# EasyEDA Pro project Image_sensor.eprj

# Schematic Schematic1
Board Name: Board1; Create Date: 2025-08-01; Page Name: P1; Project Name: Image_sensor; Schematic Name: Schematic1; Update Date: 2025-08-01; Company: 嘉立创EDA; Page Size: A4; Version: V1.0
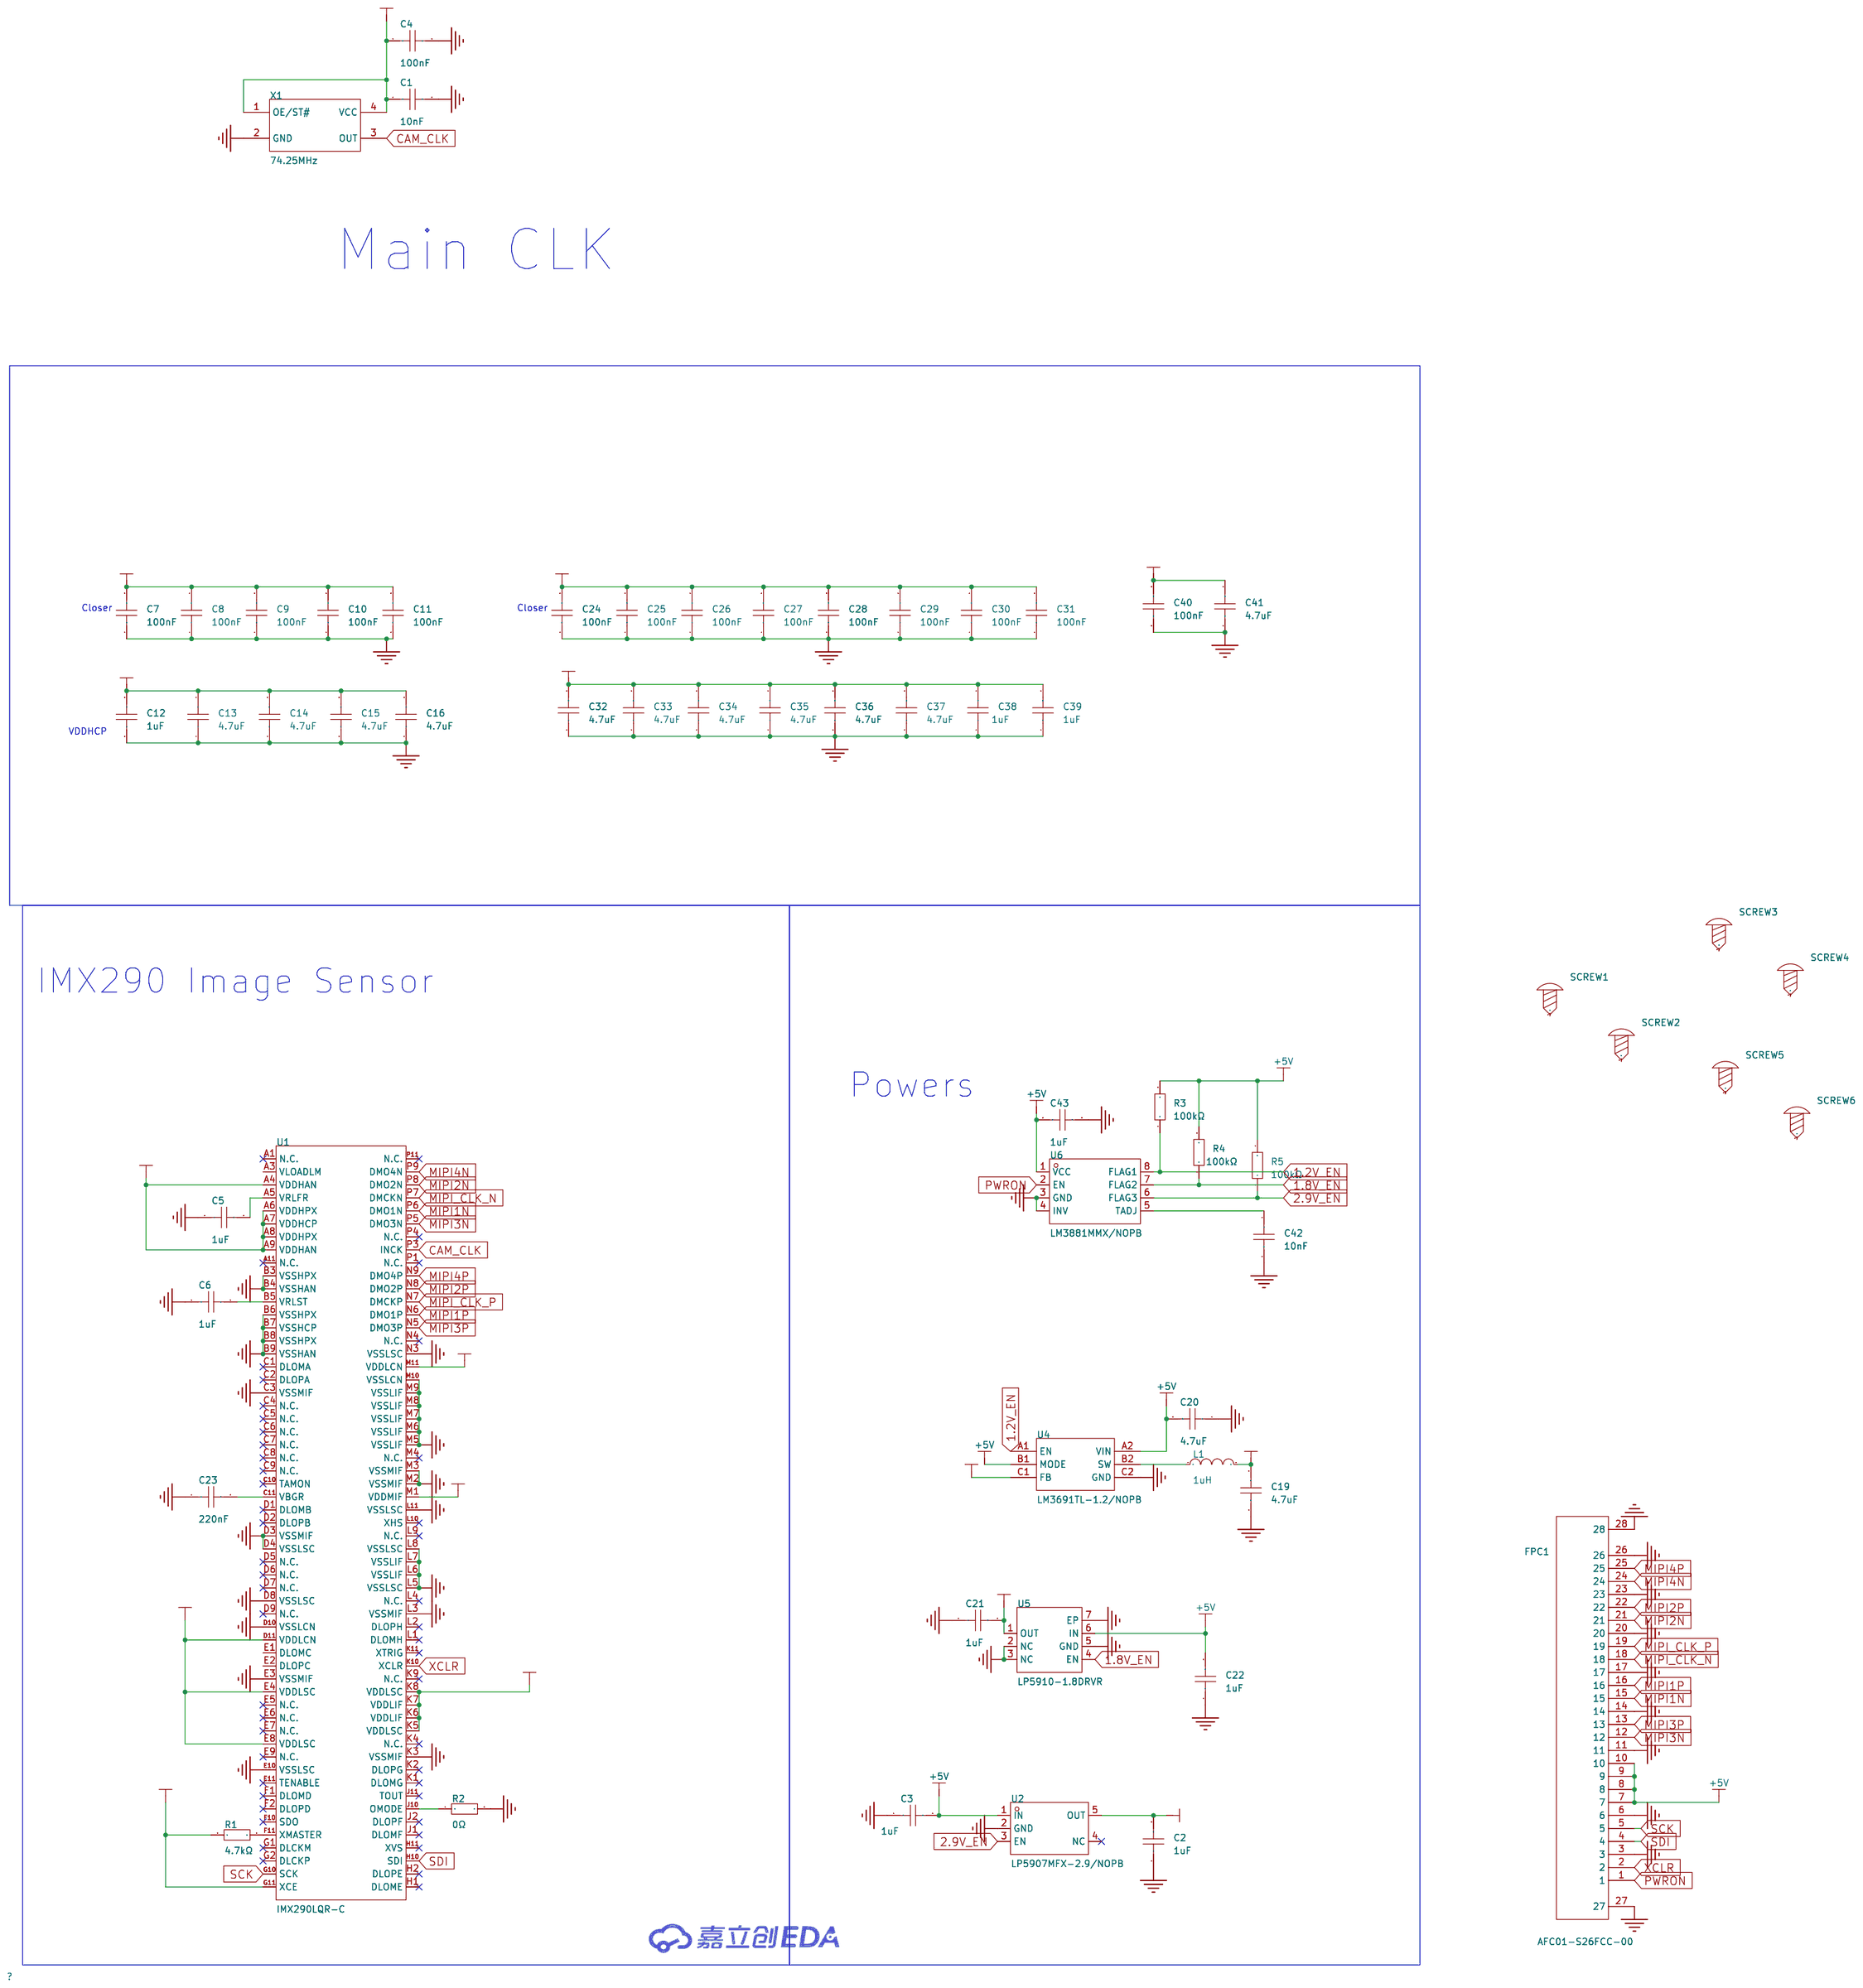
[diagram p0: schematic sheet]

## Parts
C1  10nF  [C01005]
C2  1uF  [C0201]
C3  1uF  [C0201]
C4  100nF  [C01005]
C5  1uF  [C0201]
C6  1uF  [C0201]
C7  100nF  [C01005]
C8  100nF  [C01005]
C9  100nF  [C01005]
C10  100nF  [C01005]
C11  100nF  [C01005]
C12  1uF  [C0201]
C13  4.7uF  [C0201]
C14  4.7uF  [C0201]
C15  4.7uF  [C0201]
C16  4.7uF  [C0201]
C19  4.7uF  [C0201]
C20  4.7uF  [C0201]
C21  1uF  [C0201]
C22  1uF  [C0201]
C23  220nF  [C01005]
C24  100nF  [C01005]
C25  100nF  [C01005]
C26  100nF  [C01005]
C27  100nF  [C01005]
C28  100nF  [C01005]
C29  100nF  [C01005]
C30  100nF  [C01005]
C31  100nF  [C01005]
C32  4.7uF  [C0201]
C33  4.7uF  [C0201]
C34  4.7uF  [C0201]
C35  4.7uF  [C0201]
C36  4.7uF  [C0201]
C37  4.7uF  [C0201]
C38  1uF  [C0201]
C39  1uF  [C0201]
C40  100nF  [C01005]
C41  4.7uF  [C0201]
C42  10nF  [C0201]
C43  1uF  [C0201]
FPC1  AFC01-S26FCC-00  [FPC-SMD_AFC01-S26FCC-00]
L1  1uH  [IND-SMD_L2.0-W1.6_MPH201610]
R1  4.7kΩ  [R0201]
R2  0Ω  [R0603]
R3  100kΩ  [R0201]
R4  100kΩ  [R0201]
R5  100kΩ  [R0201]
SCREW1  -  [M2螺丝]
SCREW2  -  [M2螺丝]
SCREW3  -  [M2螺丝]
SCREW4  -  [M2螺丝]
SCREW5  -  [M2螺丝]
SCREW6  -  [M2螺丝]
U1  IMX290LQR-C  [LGA-110_L12.0-W9.3-P0.80-BL_IMX291LQR-C]
U2  LP5907MFX-2.9/NOPB  [SOT-23-5_L2.9-W1.6-P0.95-LS2.8-BR]
U4  LM3691TL-1.2/NOPB  [DSBGA-6_L1.5-W1.3-R2-C3-P0.50-BL]
U5  LP5910-1.8DRVR  [WSON-6_L2.0-W2.0-P0.65-TL-EP]
U6  LM3881MMX/NOPB  [VSSOP-8_L3.0-W3.0-P0.65-LS5.0-BL]
X1  74.25MHz  [OSC-SMD_4P-L7.0-W5.0-BL_SG7050]

## Library data of the parts
C1 = CL02A103KQ2NNXC: LCSC Part Name: 10nF ±10% 6.3V; Supplier Part: C307375; Manufacturer: SAMSUNG(三星); Supplier Footprint: 01005; JLCPCB Part Class: Extended Part; Datasheet: https://atta.szlcsc.com/upload/public/pdf/source/20160218/1457707763339.pdf; Supplier: LCSC; Tolerance: ±10%; Voltage Rating: 6.3V; Temperature Coefficient: X5R
C2 C3 C5 C6 C12 C21 C22 C38 C39 = CL03A105KP3NSNC: LCSC Part Name: 1uF ±10% 10V; Supplier Part: C5209398; Manufacturer: SAMSUNG(三星); Supplier Footprint: 0201; JLCPCB Part Class: Extended Part; Datasheet: https://atta.szlcsc.com/upload/public/pdf/source/20191106/C444885_D1DE823F0ED498E02883F0194C396E9C.pdf; Supplier: LCSC; Tolerance: ±10%; Voltage Rated: 10V; Temperature Coefficient: X5R
C4 C7-C11 C24-C31 C40 = GRM022R60J104KE15D: LCSC Part Name: 100nF ±10% 6.3V; Supplier Part: C161362; Manufacturer: muRata(村田); Supplier Footprint: 01005; JLCPCB Part Class: Extended Part; Datasheet: https://atta.szlcsc.com/upload/public/pdf/source/20200305/C490387_23319AE8C154DEB24C505E6C82A8106A.pdf; Supplier: LCSC; Tolerance: ±10%; Voltage Rating: 6.3V; Temperature Coefficient: X5R
C13-C16 C19 C20 C32-C37 C41 = GRM035R60J475ME15D: LCSC Part Name: 4.7uF ±20% 6.3V; Supplier Part: C335103; Manufacturer: muRata(村田); Supplier Footprint: 0201; JLCPCB Part Class: Extended Part; Datasheet: https://atta.szlcsc.com/upload/public/pdf/source/20200305/C490387_23319AE8C154DEB24C505E6C82A8106A.pdf; Supplier: LCSC; Tolerance: ±20%; Voltage Rating: 6.3V; Temperature Coefficient: X5R
C23 = GRM022R60J224KE14D: LCSC Part Name: 220nF ±10% 6.3V; Supplier Part: C883592; Manufacturer: muRata(村田); Supplier Footprint: 01005; JLCPCB Part Class: Extended Part; Datasheet: https://atta.szlcsc.com/upload/public/pdf/source/20201027/C883551_458405A74FCB13773427E37ABAEDB4CB.pdf; Supplier: LCSC; Tolerance: ±10%; Voltage Rating: 6.3V
C42 = GRM033R71A103KA01D: LCSC Part Name: 10nF ±10% 10V; Supplier Part: C76941; Manufacturer: muRata(村田); Supplier Footprint: 0201; JLCPCB Part Class: Extended Part; Datasheet: https://atta.szlcsc.com/upload/public/pdf/source/20180307/C76941_15204091038901407729.pdf; Supplier: LCSC; Tolerance: ±10%; Voltage Rated: 10V; Temperature Coefficient: X7R
C43 = GRM033R61A105ME44D: LCSC Part Name: 1uF ±20% 10V; Supplier Part: C76935; Manufacturer: muRata(村田); Supplier Footprint: 0201; JLCPCB Part Class: Extended Part; Datasheet: https://atta.szlcsc.com/upload/public/pdf/source/20190904/C426118_85E81C7C1F21FC87C5FB6D536E0847B4.pdf; Supplier: LCSC; Tolerance: ±20%; Voltage Rated: 10V; Temperature Coefficient: X5R
FPC1 = AFC01-S26FCC-00: LCSC Part Name: 间距:0.5mm P数:26P 翻盖式 下接; Supplier Part: C262277; Manufacturer: JS(钜硕电子); Supplier Footprint: SMD,P=0.5mm,卧贴; JLCPCB Part Class: Extended Part; Datasheet: https://atta.szlcsc.com/upload/public/pdf/source/20190816/C413942_2A72D1AC756EAE17EEDF756A339D4500.pdf; Supplier: LCSC; Locking Feature: 翻盖式; Contact Type: 下接; Number of Contacts: 26P; Pitch: 0.5mm; Mounting Type: 卧贴; FFC, FCB Thickness: 0.3mm; Height Above Board: 2mm
L1 = MPH201610S1R0MT: LCSC Part Name: 1uH ±20% 1A; Supplier Part: C279813; Manufacturer: Sunlord(顺络); Supplier Footprint: 0806; JLCPCB Part Class: Extended Part; Datasheet: https://atta.szlcsc.com/upload/public/pdf/source/20241120/D50FD5550E500CE51CF2F3A3AE14E46E.pdf; Supplier: LCSC; Tolerance: ±20%; Rated Current: 1A; Current - Saturation (Isat): 1A; DC Resistance(DCR): 90mΩ; Frequency - Self Resonant: 70MHz
R1 = 0201WMF4701TEE: LCSC Part Name: 4.7kΩ ±1% 50mW 厚膜电阻; Supplier Part: C270346; Manufacturer: UNI-ROYAL(厚声); Supplier Footprint: 0201; JLCPCB Part Class: Extended Part; Datasheet: https://atta.szlcsc.com/upload/public/pdf/source/20200306/C422600_1E6D84923E4A46A82E41ADD87F860B5C.pdf; Supplier: LCSC; Type: 厚膜电阻; Tolerance: ±1%; Power(Watts): 50mW; Overload Voltage (Max): 25V; Temperature Coefficient: ±200ppm/℃; Operating Temperature Range: -55℃~+155℃
R2 = 0603WAF0000T5E: LCSC Part Name: 0Ω ±1% 100mW 厚膜电阻; Supplier Part: C21189; Manufacturer: UNI-ROYAL(厚声); Supplier Footprint: 0603; JLCPCB Part Class: Basic Part; Datasheet: https://atta.szlcsc.com/upload/public/pdf/source/20200306/C422600_1E6D84923E4A46A82E41ADD87F860B5C.pdf; Supplier: LCSC; Type: 厚膜电阻; Tolerance: ±1%; Power(Watts): 100mW; Voltage-Supply(Max): 75V; Operating Temperature: -55℃~+155℃
R3-R5 = 0201WMF1003TEE: LCSC Part Name: 100kΩ ±1% 50mW 厚膜电阻; Supplier Part: C270364; Manufacturer: UNI-ROYAL(厚声); Supplier Footprint: 0201; JLCPCB Part Class: Extended Part; Datasheet: https://atta.szlcsc.com/upload/public/pdf/source/20200306/C422600_1E6D84923E4A46A82E41ADD87F860B5C.pdf; Supplier: LCSC; Type: 厚膜电阻; Tolerance: ±1%; Power(Watts): 50mW; Overload Voltage (Max): 25V; Temperature Coefficient: ±200ppm/℃; Operating Temperature Range: -55℃~+155℃
SCREW1-SCREW6 = M2螺丝: Supplier Footprint: 插件
U1 = IMX290LQR-C: Supplier Part: C5249315; Manufacturer: Sony(索尼); Supplier Footprint: LGA-110; JLCPCB Part Class: 扩展库; Datasheet: https://atta.szlcsc.com/upload/public/pdf/source/20230906/B553CB6F46D914DB518133BEFA776B57.pdf; Supplier: LCSC
U2 = LP5907MFX-2.9/NOPB: LCSC Part Name: 具有低 IQ 和使能功能的 250mA、低噪声、高 PSRR、超低压降稳压器; Supplier Part: C2877839; Manufacturer: TI(德州仪器); Supplier Footprint: SOT-23-5; JLCPCB Part Class: Extended Part; Datasheet: https://www.ti.com/cn/lit/gpn/lp5907; Supplier: LCSC; Output Type: 固定; Maximum Input Voltage: 5.5V; Output Voltage: 2.9V; Output Current: 250mA; Dropout Voltage: 250mV@(250mA); standby current: 25uA; Feature: 防静电保护；短路保护；自动放电功能；低ESR；热保护(TSD)；欠压闭锁；带使能; Operating Temperature: -40℃~+125℃@(Tj); Output Polarity: 正极; Number of Outputs: 1
U4 = LM3691TL-1.2/NOPB: Supplier Part: C2072378; Manufacturer: TI(德州仪器); Supplier Footprint: DSBGA-6(1.3x1.5); JLCPCB Part Class: 扩展库; Datasheet: https://www.ti.com/cn/lit/gpn/lm3691; Supplier: LCSC; Function: 降压型; Output Type: 固定; Input Voltage: 2.3V~5.5V; Output Voltage: 1.2V; Output Current: 1A; Switching Frequency: 4MHz; Operating Temperature: -30℃~+85℃@(TA); Synchronous Rectification: 是; Number of Outputs: 1; Topology: 降压式; Switch tube (built-in/external): 内置
U5 = LP5910-1.8DRVR: LCSC Part Name: 具有反向电流保护和使能功能的 300mA、低噪声、低 IQ、低压降稳压器; Supplier Part: C2867568; Manufacturer: TI(德州仪器); Supplier Footprint: WSON-6-EP(2x2); JLCPCB Part Class: 扩展库; Datasheet: https://www.ti.com/cn/lit/gpn/lp5910; Supplier: LCSC; Output Type: 固定; Voltage - Supply: 3.3V; Output Voltage: 1.8V; Output Current: 300mA; standby current: 25uA; Features: 防静电保护；短路保护；自动放电功能；低ESR；热保护(TSD)；过流保护(OCP)；带使能；防倒灌; Operating Temperature: -40℃~+125℃@(Tj); Output Configuration: 正极; Number of Outputs: 1
U6 = LM3881MMX/NOPB: Supplier Part: C527405; Manufacturer: TI(德州仪器); Supplier Footprint: VSSOP-8-0.65mm; JLCPCB Part Class: 扩展库; Datasheet: https://www.ti.com/cn/lit/gpn/lm3881; Supplier: LCSC; ChipType: 序列发生器; Output Type: 开漏; Voltage - Supply: 2.7V~5.5V; Number of Voltages Monitored: 3; Manual Reset: 无; Watchdog: 无; Reset Timeout: 10.8ms; Operating Temperature: -40℃~+125℃@(Tj)
X1 = X1G0044810047: Supplier Part: C52014; Manufacturer: EPSON(爱普生); Supplier Footprint: SMD7050-4P; JLCPCB Part Class: 扩展库; Datasheet: https://atta.szlcsc.com/upload/public/pdf/source/20161110/1478747518408.pdf; Supplier: LCSC; Voltage - Supply: 1.6V~3.6V; Current - Supply: 11mA; Frequency Stability: ±50ppm; Operating Temperature: -40℃~+85℃

## Nets
1.2V: C19.2 C24.2 C25.2 C26.2 C27.2 C28.2 C29.2 C30.2 C31.2 C32.2 C33.2 C34.2 C35.2 C36.2 C37.2 C38.2 C39.2 L1.2 U1.D11(VDDLCN) U1.E4(VDDLSC) U1.E8(VDDLSC) U1.K5(VDDLSC) U1.K6(VDDLIF) U1.K7(VDDLIF) U1.K8(VDDLSC) U1.M11(VDDLCN) U4.C1(FB)
1.2V_EN: R3.1 U4.A1(EN) U6.8(FLAG1)
1.8V: C21.2 C40.2 C41.2 R1.1 U1.G11(XCE) U1.M1(VDDMIF) U5.1(OUT)
1.8V_EN: R4.1 U5.4(EN) U6.7(FLAG2)
2.9V: C1.1 C2.2 C4.1 C7.2 C8.2 C9.2 C10.2 C11.2 C12.2 C13.2 C14.2 C15.2 C16.2 U1.A4(VDDHAN) U1.A6(VDDHPX) U1.A7(VDDHCP) U1.A8(VDDHPX) U1.A9(VDDHAN) U2.5(OUT) X1.1(OE/ST#) X1.4(VCC)
2.9V_EN: R5.1 U2.3(EN) U6.6(FLAG3)
+5V: C3.2 C20.2 C22.2 C43.1 FPC1.7 FPC1.8 FPC1.9 FPC1.10 R3.2 R4.2 R5.2 U2.1(IN) U4.A2(VIN) U4.B1(MODE) U5.6(IN) U6.1(VCC)
GND: C1.2 C2.1 C3.1 C4.2 C5.1 C6.1 C7.1 C8.1 C9.1 C10.1 C11.1 C12.1 C13.1 C14.1 C15.1 C16.1 C19.1 C20.1 C21.1 C22.1 C23.1 C24.1 C25.1 C26.1 C27.1 C28.1 C29.1 C30.1 C31.1 C32.1 C33.1 C34.1 C35.1 C36.1 C37.1 C38.1 C39.1 C40.1 C41.1 C42.2 C43.2 FPC1.3 FPC1.6 FPC1.11 FPC1.14 FPC1.17 FPC1.20 FPC1.23 FPC1.26 FPC1.27 FPC1.28 R2.2 U1.B3(VSSHPX) U1.B4(VSSHAN) U1.B6(VSSHPX) U1.B7(VSSHCP) U1.B8(VSSHPX) U1.B9(VSSHAN) U1.C3(VSSMIF) U1.D3(VSSMIF) U1.D4(VSSLSC) U1.D8(VSSLSC) U1.D10(VSSLCN) U1.E3(VSSMIF) U1.E10(VSSLSC) U1.K3(VSSMIF) U1.L3(VSSMIF) U1.L5(VSSLSC) U1.L6(VSSLIF) U1.L7(VSSLIF) U1.L8(VSSLSC) U1.L11(VSSLSC) U1.M2(VSSMIF) U1.M3(VSSMIF) U1.M5(VSSLIF) U1.M6(VSSLIF) U1.M7(VSSLIF) U1.M8(VSSLIF) U1.M9(VSSLIF) U1.M10(VSSLCN) U1.N3(VSSLSC) U2.2(GND) U4.C2(GND) U5.2(NC) U5.3(NC) U5.5(GND) U5.7(EP) U6.3(GND) U6.4(INV) X1.2(GND)
CAM_CLK: U1.P3(INCK) X1.3(OUT)
MIPI1N: FPC1.15 U1.P6(DMO1N)
MIPI1P: FPC1.16 U1.N6(DMO1P)
MIPI2N: FPC1.21 U1.P8(DMO2N)
MIPI2P: FPC1.22 U1.N8(DMO2P)
MIPI3N: FPC1.12 U1.P5(DMO3N)
MIPI3P: FPC1.13 U1.N5(DMO3P)
MIPI4N: FPC1.24 U1.P9(DMO4N)
MIPI4P: FPC1.25 U1.N9(DMO4P)
MIPI_CLK_N: FPC1.18 U1.P7(DMCKN)
MIPI_CLK_P: FPC1.19 U1.N7(DMCKP)
PWRON: FPC1.1 U6.2(EN)
SCK: FPC1.5 U1.G10(SCK)
SDI: FPC1.4 U1.H10(SDI)
XCLR: FPC1.2 U1.K10(XCLR)
$1N3514: C5.2 U1.A5(VRLFR)
$1N3616: C6.2 U1.B5(VRLST)
$1N4894: L1.1 U4.B2(SW)
$1N5592: C23.2 U1.C11(VBGR)
$1N6784: R1.2 U1.F11(XMASTER)
$1N6846: R2.1 U1.J10(OMODE)
$1N8560: C42.1 U6.5(TADJ)

Not connected (* = marked no-connect by the designer): SCREW1 1; SCREW2 1; SCREW3 1; SCREW4 1; SCREW5 1; SCREW6 1; U1 A1(N.C.)* A3(VLOADLM) A11(N.C.)* C1(DLOMA)* C2(DLOPA)* C4(N.C.)* C5(N.C.)* C6(N.C.)* C7(N.C.)* C8(N.C.)* C9(N.C.)* C10(TAMON)* D1(DLOMB)* D2(DLOPB)* D5(N.C.)* D6(N.C.)* D7(N.C.)* D9(N.C.)* E1(DLOMC) E2(DLOPC) E5(N.C.)* E6(N.C.)* E7(N.C.)* E9(N.C.)* E11(TENABLE)* F1(DLOMD)* F2(DLOPD)* F10(SDO)* G1(DLCKM)* G2(DLCKP)* H1(DLOME)* H2(DLOPE)* H11(XVS)* J1(DLOMF)* J2(DLOPF)* J11(TOUT)* K1(DLOMG)* K2(DLOPG)* K4(N.C.)* K9(N.C.)* K11(XTRIG)* L1(DLOMH)* L2(DLOPH)* L4(N.C.)* L9(N.C.)* L10(XHS)* M4(N.C.)* N4(N.C.)* P1(N.C.)* P4(N.C.)* P11(N.C.)*; U2 4(NC)*

## Notes on the sheet
- Main CLK
- Closer
- Closer
- VDDHCP
- IMX290 Image Sensor
- Powers

# Board PCB1
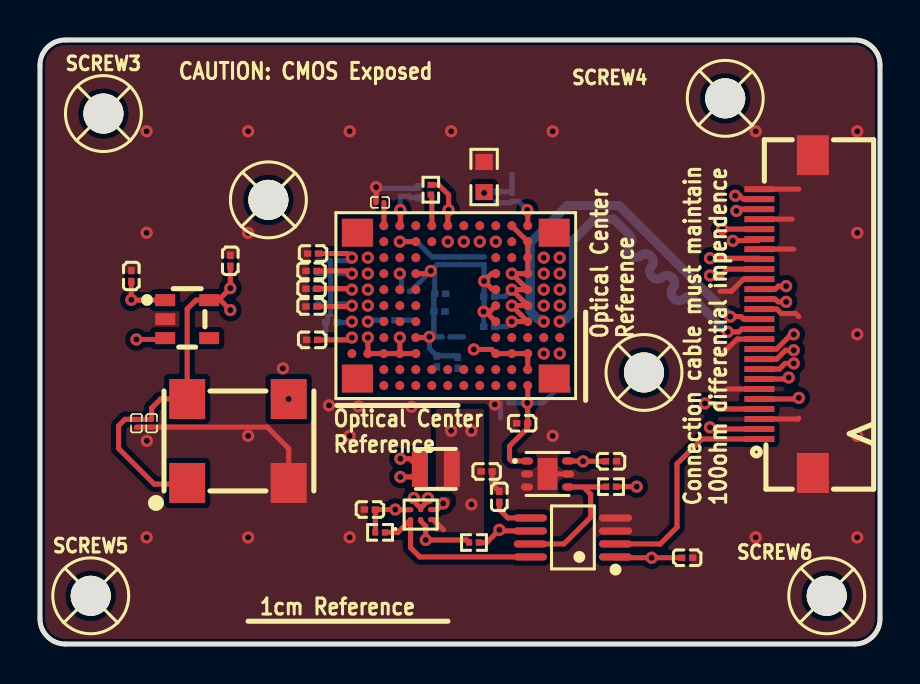
[diagram p1: board, top side]
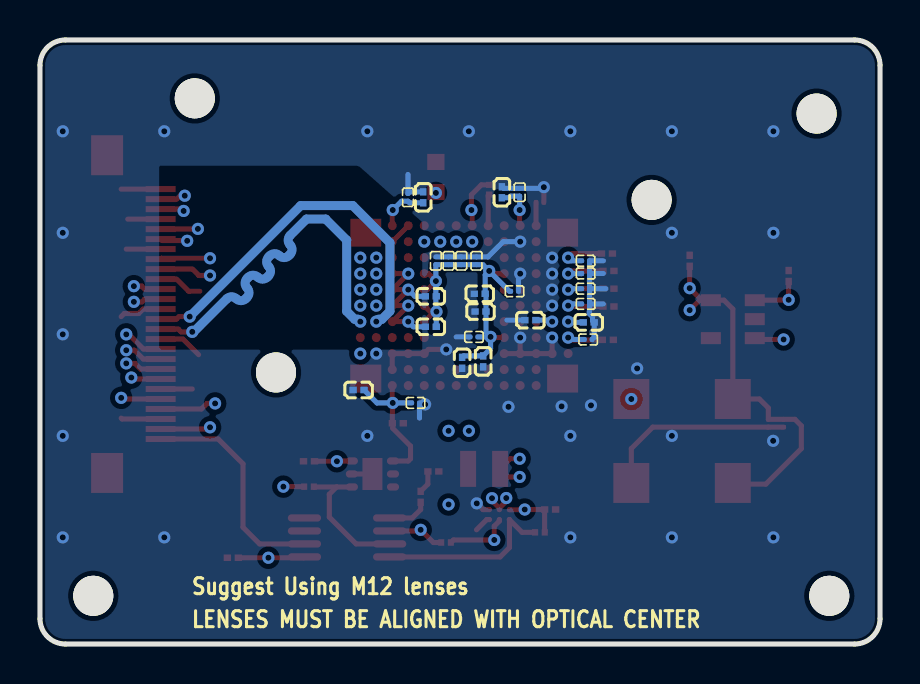
[diagram p2: board, bottom side, seen from below]

Outline 42.04 x 30.23 mm; copper layers: Top Layer, Inner1, Inner2, Inner3, Inner4, Bottom Layer. Coordinates in mm from the lower left corner of the outline.
Outline path: 0,28.96 0,1.27 arc(0.37,0.37) 1.27,0 40.77,0 arc(41.67,0.37) 42.04,1.27 42.04,28.96 arc(41.67,29.85) 40.77,30.23 1.27,30.23 arc(0.37,29.85) 0,28.96
Stack: Top Layer 0.035mm 外层铜厚1oz / Dielectric1 0.0994mm 3313 RC57% 4.2mil / Inner1 0.0152mm 内层铜厚 / Dielectric2 0.55mm 0.55mm H/H No copper / Inner2 0.0152mm 内层铜厚 / Dielectric3 0.1088mm 2116 RC54% 4.9mil / Inner3 0.0152mm 内层铜厚 / Dielectric4 0.55mm 0.55mm H/H No copper / Inner4 0.0152mm 内层铜厚 / Dielectric5 0.0994mm 3313 RC57% 4.2mil / Bottom Layer 0.035mm 外层铜厚1oz

## Design rules (mm)
net MIPI4N: MIPI4
net MIPI2N: MIPI2
net MIPI_CLK_N: MIPI_CLK
net MIPI1N: MIPI1
net MIPI3N: MIPI3
net MIPI4P: MIPI4
net MIPI2P: MIPI2
net MIPI_CLK_P: MIPI_CLK
net MIPI1P: MIPI1
net MIPI3P: MIPI3
template: 自定义配置
spacing copperThickness1oz (default): track to track 0.102, other pairs 0.152 to 0.3
spacing copperThickness2oz: track to track 0.203, other pairs 0.152 to 0.3
track width copperThickness1oz (default): min 0.127, default 0.254, max 2.54
track width copperThickness2oz: min 0.203, default 0.254, max 2.54
differential pair differentialPair (default): width min 0.127, default 0.254, max 2.54; gap min 0.152, default 0.203
via viaSize (default): diameter min 0.5, default 0.61, max 10; hole min 0.3, default 0.305, max 6.3
net GND uses HiCurrRegion
net +5V uses HiCurrRegion
net 1.2V uses HiCurrRegion

## Placement (name value [footprint] x y rotation side)
C1  10nF  [C01005]  5.59 11.05 270 top
C2  1uF  [C0201]  9.53 19.18 270 top
C3  1uF  [C0201]  4.57 18.42 270 top
C4  100nF  [C01005]  4.83 11.05 270 top
C5  1uF  [C0201]  14.58 16.09 0 bottom
C6  1uF  [C0201]  17.5 16.21 180 bottom
C7  100nF  [C01005]  14.73 18.54 0 bottom
C8  100nF  [C01005]  14.73 17.78 0 bottom
C9  100nF  [C01005]  14.73 19.18 0 bottom
C10  100nF  [C01005]  14.73 17.02 0 bottom
C11  100nF  [C01005]  14.6 15.24 0 bottom
C12  1uF  [C0201]  13.59 17.78 0 top
C13  4.7uF  [C0201]  13.59 18.67 0 top
C14  4.7uF  [C0201]  13.66 19.54 0 top
C15  4.7uF  [C0201]  13.59 16.89 0 top
C16  4.7uF  [C0201]  13.62 15.22 0 top
C19  4.7uF  [C0201]  22.35 8.64 180 top
C20  4.7uF  [C0201]  16.51 6.73 0 top
C21  1uF  [C0201]  24.13 11.05 0 top
C22  1uF  [C0201]  28.57 9.14 180 top
C23  220nF  [C01005]  17.02 22.1 0 top
C24  100nF  [C01005]  22.22 19.18 270 bottom
C25  100nF  [C01005]  21.59 19.18 270 bottom
C26  100nF  [C01005]  20.96 19.18 270 bottom
C27  100nF  [C01005]  20.32 15.37 180 bottom
C28  100nF  [C01005]  20.19 19.18 270 bottom
C29  100nF  [C01005]  18.29 17.65 0 bottom
C30  100nF  [C01005]  23.62 22.35 270 bottom
C31  100nF  [C01005]  18.03 22.61 270 bottom
C32  4.7uF  [C0201]  19.86 14.14 90 bottom
C33  4.7uF  [C0201]  20.03 17.53 180 bottom
C34  4.7uF  [C0201]  22.86 22.35 270 bottom
C35  4.7uF  [C0201]  18.92 22.61 270 bottom
C36  4.7uF  [C0201]  19.99 16.64 180 bottom
C37  4.7uF  [C0201]  20.91 14.07 90 bottom
C38  1uF  [C0201]  22.48 17.4 180 bottom
C39  1uF  [C0201]  22.48 15.88 180 bottom
C40  100nF  [C01005]  23.24 12.07 0 bottom
C41  4.7uF  [C0201]  26.09 12.71 180 bottom
C42  10nF  [C0201]  22.99 7.37 90 top
C43  1uF  [C0201]  32.38 4.32 0 top
FPC1  AFC01-S26FCC-00  [FPC-SMD_AFC01-S26FCC-00]  37.34 16.51 90 top
L1  1uH  [IND-SMD_L2.0-W1.6_MPH201610]  19.81 8.76 0 top
R1  4.7kΩ  [R0201]  19.56 22.73 270 top
R2  0Ω  [R0603]  22.22 23.37 90 top
R3  100kΩ  [R0201]  17.02 5.59 180 top
R4  100kΩ  [R0201]  28.57 7.87 0 top
R5  100kΩ  [R0201]  21.72 5.08 180 top
SCREW1  -  [M2螺丝]  11.43 22.23 0 top
SCREW2  -  [M2螺丝]  30.23 13.59 0 top
SCREW3  -  [M2螺丝]  3.18 26.54 0 top
SCREW4  -  [M2螺丝]  34.29 27.31 0 top
SCREW5  -  [M2螺丝]  2.54 2.41 0 top
SCREW6  -  [M2螺丝]  39.37 2.41 0 top
U1  IMX290LQR-C  [LGA-110_L12.0-W9.3-P0.80-BL_IMX291LQR-C]  20.81 16.93 0 top
U2  LP5907MFX-2.9/NOPB  [SOT-23-5_L2.9-W1.6-P0.95-LS2.8-BR]  7.37 16.26 180 top
U4  LM3691TL-1.2/NOPB  [DSBGA-6_L1.5-W1.3-R2-C3-P0.50-BL]  19.05 6.48 0 top
U5  LP5910-1.8DRVR  [WSON-6_L2.0-W2.0-P0.65-TL-EP]  25.4 8.51 0 top
U6  LM3881MMX/NOPB  [VSSOP-8_L3.0-W3.0-P0.65-LS5.0-BL]  26.67 5.33 90 top
X1  74.25MHz  [OSC-SMD_4P-L7.0-W5.0-BL_SG7050]  9.91 10.16 0 top

## Footprints (pads in the part's own frame, mm; a bottom-side part is the same pattern mirrored in y, then rotated)
C0201
  rect 0.368x0.324 smd: 1(-0.275,0) 2(0.275,0)
C01005
  rect 0.21x0.22 smd: 1(-0.195,0) 2(0.195,0)
DSBGA-6_L1.5-W1.3-R2-C3-P0.50-BL
  round 0.256 smd: A1(-0.5,-0.25) A2(-0.5,0.25) B1(0,-0.25) B2(0,0.25) C1(0.5,-0.25) C2(0.5,0.25)
FPC-SMD_AFC01-S26FCC-00
  rect 0.3x1.5 smd: 1(-6.25,1.339) 2(-5.75,1.339) 3(-5.25,1.339) 4(-4.75,1.339) 5(-4.25,1.339) 6(-3.749,1.339) 7(-3.248,1.339) 8(-2.749,1.339) 9(-2.251,1.339) 10(-1.75,1.339) 11(-1.25,1.339) 12(-0.75,1.339) 13(-0.249,1.339) 14(0.25,1.339) 15(0.75,1.339) 16(1.25,1.339) 17(1.75,1.339) 18(2.251,1.339) 19(2.751,1.339) 20(3.251,1.339) 21(3.752,1.339) 22(4.25,1.339) 23(4.75,1.339) 24(5.25,1.339) 25(5.75,1.339) 26(6.251,1.339)
  rect 2x1.6 smd: 27(-7.95,-1.339) 28(7.95,-1.339)
IND-SMD_L2.0-W1.6_MPH201610
  rect 0.8x1.8 smd: 1(-0.8,0) 2(0.8,0)
LGA-110_L12.0-W9.3-P0.80-BL_IMX291LQR-C
  rect 1.55x1.4 smd: A1(-4.925,-3.65) A11(-4.925,3.65) P1(4.925,-3.65) P11(4.925,3.65)
  round 0.45 smd: A3(-5.2,-2.4) A4(-5.2,-1.6) A5(-5.2,-0.8) A6(-5.2,0) A7(-5.2,0.8) A8(-5.2,1.6) A9(-5.2,2.4) B3(-4.4,-2.4) B4(-4.4,-1.6) B5(-4.4,-0.8) B6(-4.4,0) B7(-4.4,0.8) B8(-4.4,1.6) B9(-4.4,2.4) C1(-3.6,-4) C2(-3.6,-3.2) C3(-3.6,-2.4) C4(-3.6,-1.6) C5(-3.6,-0.8) C6(-3.6,0) C7(-3.6,0.8) C8(-3.6,1.6) C9(-3.6,2.4) C10(-3.6,3.2) C11(-3.6,4) D1(-2.8,-4) D2(-2.8,-3.2) D3(-2.8,-2.4) D4(-2.8,-1.6) D5(-2.8,-0.8) D6(-2.8,0) D7(-2.8,0.8) D8(-2.8,1.6) D9(-2.8,2.4) D10(-2.8,3.2) D11(-2.8,4) E1(-2,-4) E2(-2,-3.2) E3(-2,-2.4) E4(-2,-1.6) E5(-2,-0.8) E6(-2,0) E7(-2,0.8) E8(-2,1.6) E9(-2,2.4) E10(-2,3.2) E11(-2,4) F1(-1.2,-4) F2(-1.2,-3.2) F10(-1.2,3.2) F11(-1.2,4) G1(-0.4,-4) G2(-0.4,-3.2) G10(-0.4,3.2) G11(-0.4,4) H1(0.4,-4) H2(0.4,-3.2) H10(0.4,3.2) H11(0.4,4) J1(1.2,-4) J2(1.2,-3.2) J10(1.2,3.2) J11(1.2,4) K1(2,-4) K2(2,-3.2) K3(2,-2.4) K4(2,-1.6) K5(2,-0.8) K6(2,0) K7(2,0.8) K8(2,1.6) K9(2,2.4) K10(2,3.2) K11(2,4) L1(2.8,-4) L2(2.8,-3.2) L3(2.8,-2.4) L4(2.8,-1.6) L5(2.8,-0.8) L6(2.8,0) L7(2.8,0.8) L8(2.8,1.6) L9(2.8,2.4) L10(2.8,3.2) L11(2.8,4) M1(3.6,-4) M2(3.6,-3.2) M3(3.6,-2.4) M4(3.6,-1.6) M5(3.6,-0.8) M6(3.6,0) M7(3.6,0.8) M8(3.6,1.6) M9(3.6,2.4) M10(3.6,3.2) M11(3.6,4) N3(4.4,-2.4) N4(4.4,-1.6) N5(4.4,-0.8) N6(4.4,0) N7(4.4,0.8) N8(4.4,1.6) N9(4.4,2.4) P3(5.2,-2.4) P4(5.2,-1.6) P5(5.2,-0.8) P6(5.2,0) P7(5.2,0.8) P8(5.2,1.6) P9(5.2,2.4)
M2螺丝
  round 2 hole 2: 1(0,0)
OSC-SMD_4P-L7.0-W5.0-BL_SG7050
  rect 1.8x2 smd: 1(-2.54,-2.1) 2(2.54,-2.1) 3(2.54,2.1) 4(-2.54,2.1)
R0201
  rect 0.303x0.324 smd: 1(-0.241,0) 2(0.241,0)
R0603
  rect 0.806x0.864 smd: 1(-0.753,0) 2(0.753,0)
SOT-23-5_L2.9-W1.6-P0.95-LS2.8-BR
  rect 1x0.6 smd: 1(1.1,-0.95) 2(1.1,0) 3(1.1,0.95) 4(-1.1,0.95) 5(-1.1,-0.95)
VSSOP-8_L3.0-W3.0-P0.65-LS5.0-BL
  oval 0.364x1.662 smd: 1(-0.975,-2.131) 2(-0.325,-2.131) 3(0.325,-2.131) 4(0.975,-2.131) 5(0.975,2.131) 6(0.325,2.131) 7(-0.325,2.131) 8(-0.975,2.131)
WSON-6_L2.0-W2.0-P0.65-TL-EP
  oval 0.607x0.364 smd: 1(-1.028,0.65) 2(-1.028,0) 3(-1.028,-0.65) 4(1.028,-0.65) 5(1.028,0) 6(1.028,0.65)
  rect 1x1.6 smd: 7(0,0)

## Nets
As in the schematic.

Pads without a net: SCREW1 1; SCREW2 1; SCREW3 1; SCREW4 1; SCREW5 1; SCREW6 1; U1 A1 A3 A11 C1 C2 C4 C5 C6 C7 C8 C9 C10 D1 D2 D5 D6 D7 D9 E1 E2 E5 E6 E7 E9 E11 F1 F2 F10 G1 G2 H1 H2 H11 J1 J2 J11 K1 K2 K4 K9 K11 L1 L2 L4 L9 L10 M4 N4 P1 P4 P11; U2 4

## Via types
v1: diameter 0.61, hole 0.305, Top Layer to Bottom Layer, 108 vias

## Routing (per net, layer and track width the routed paths; a pad name or vN(x,y) marks a point on that pad's centre or on a via; arc(x,y) is an arc through that point)
1.2V: length 23.9
  Top Layer w0.254: v1(18.03,21.72) 18.03,20.96 U1.D11 ; U4.C1 19.68,6.23 20.19,5.72 ; v1(24.38,21.72) 24.41,21.69 U1.M11 ; U1.E4 19.45,15.33 v1(19.49,15.37) ; 18.81,18.53 19.42,18.53 v1(19.56,18.67) ; 22.81,16.13 22.31,16.63 22.51,16.63 U1.K6 ; 22.81,18.53 22.6,18.53 v1(22.22,18.16) 22.65,17.73 U1.K7
  Bottom Layer w0.254: C29.2 18.54,17.65 v1(19.56,18.67) ; C27.2 19.49,15.37 v1(19.49,15.37) ; v1(19.56,18.67) 19.76,18.47 C33.2 19.72,17.49 C36.2 19.72,15.6 v1(19.49,15.37) ; v1(19.56,18.67) 19.87,18.98 C28.2 C26.2 C25.2 C24.2 v1(22.22,18.16) 22.22,16.66 v1(22.2,16.63) 22.2,16.62 C39.2 ; v1(19.49,15.37) 19.49,14.79 C32.2 20.84,14.42 C37.2 ; C35.2 18.56,22.33 18.48,22.41 C31.2 v1(18.03,21.72) ; v1(24.38,21.72) 23.94,22.16 C30.2 23.54,22.08 C34.2
  vias: v1(20.57,10.67) v1(21.59,10.67) v1(21.59,6.98)
1.2V_EN: length 9.1
  Top Layer w0.254: U6.8 19.01,4.36 18.54,4.83 18.54,6.22 ; 18.54,6.22 17.91,5.59 R3.1 ; 18.54,6.22 U4.A1
1.8V: length 22.6
  Top Layer w0.254: C21.2 24.4,12.04 v1(24.38,12.07) 24.41,12.09 U1.M1 ; U1.G11 20.41,21.68 v1(20.45,21.72) 20.45,22.48 19.95,22.97 R1.1 ; U5.1 23.61,9.16 23.5,9.27 23.5,9.91 24.38,10.8 24.38,10.92
  Inner4 w0.254: v1(20.45,21.72) 22.48,21.72 24.38,19.81 v1(24.38,12.07)
  Bottom Layer w0.254: C41.2 25.17,12.07 v1(24.38,12.07) C40.2
1.8V_EN: length 7.1
  Top Layer w0.254: 27.19,7.86 28.32,7.86 R4.1 ; 27.19,7.86 27.56,7.49 27.56,6.35 26.22,5.01 U6.7 ; 27.19,7.86 26.43,7.86
2.9V: length 31.2
  Top Layer w0.254: 8.93,17.21 v1(9.53,17.81) C2.2 ; 8.93,17.21 U2.5 7.81,17.21 7.37,16.76 X1.4 6.04,12.26 5.59,11.81 C1.1 C4.1 4.26,11.24 3.94,10.92 3.94,9.78 5.72,8 7.31,8 X1.1 ; 8.93,17.21 9.03,17.21 v1(9.53,16.71) ; C14.2 15.4,19.54 v1(15.61,19.33) ; C13.2 15.47,18.67 v1(15.61,18.53) ; v1(15.61,17.73) 15.56,17.78 C12.2 ; v1(15.61,16.93) 15.57,16.89 C15.2 ; 13.9,15.22 15.5,15.22 v1(15.61,15.33)
  Bottom Layer w0.254: C9.2 15.45,19.18 v1(15.61,19.33) ; v1(15.61,18.53) 14.94,18.53 C7.2 ; C11.2 15.51,15.24 v1(15.61,15.33) ; v1(15.61,16.93) 15.52,17.02 C10.2 ; v1(15.61,17.73) 15.56,17.78 C8.2
2.9V_EN: length 26.8
  Top Layer w0.254: U2.3 6.2,15.24 v1(4.83,15.24) ; U6.6 23.04,5.66 v1(22.99,5.72) 22.35,5.08 R5.1
  Inner3 w0.254: v1(22.99,5.72) 22.17,6.53 22.17,7.23 21.83,7.57 21.13,7.57 13.46,15.24 v1(4.83,15.24)
+5V: length 22.4
  Top Layer w0.254: R3.2 16.78,5.6 C20.2 v1(17.78,6.73) 17.79,6.72 18.55,6.72 ; R4.2 v1(29.86,7.87) ; U4.B1 19.05,6.15 19.3,5.9 v1(19.3,5.21) 21.35,5.21 R5.2 ; C3.2 v1(4.57,17.22) 4.59,17.21 U2.1 ; U5.6 27.16,9.16 v1(27.18,9.14) C22.2 ; FPC1.10 36.86,14.76 37.59,15.49 v1(37.72,15.49) ; v1(37.72,14.04) 37.28,14.04 37,13.76 FPC1.8 ; FPC1.7 37.39,13.26 v1(37.47,13.34) ; C43.1 v1(30.61,4.32) 28.84,4.32 U6.1 ; v1(37.72,14.7) 37.31,14.7 36.87,14.26 FPC1.9
GND: length 107.2
  Top Layer w0.254: v1(20.18,7.04) 19.87,6.73 U4.C2 ; C42.2 22.63,8 C19.1 ; U1.L11 U1.M10 U1.M9 24.41,18.53 v1(23.61,18.53) U1.M7 v1(23.61,17.73) U1.M6 v1(23.61,16.93) 24.41,16.13 v1(23.61,16.13) ; FPC1.6 34.42,12.76 ; FPC1.11 34.88,15.26 34.1,14.48 ; FPC1.20 37.72,19.76 ; C23.1 v1(16.82,22.86) ; X1.2 12.45,9.78 11.37,10.85 C1.2 C4.2 ; FPC1.3 37.93,11.26 37.97,11.3 ; FPC1.17 35.2,18.26 34.6,17.65 34.04,17.65 ; 18.01,14.53 v1(18.01,15.33) ; 18.01,14.53 16.41,14.53 v1(16.41,15.33) ; 18.01,14.53 18.81,14.53 ; v1(21.71,14.74) 22.6,14.74 22.81,14.53 24.41,14.53 U1.M2 ; U1.E10 v1(18.01,20.13) ; U5.5 U5.7 ; FPC1.14 36.87,16.76 37.1,16.54 37.82,16.54 37.97,16.38 ; 37.64,21.26 FPC1.23 ; FPC1.26 37.97,22.76
  Inner2 w0.254: v1(21.71,14.74) 24.11,14.74 24.59,14.26 24.59,13.6 23.92,12.93 13.02,12.93 v1(12.16,13.79) 11.47,13.11 11.47,11.43 11.65,11.25 12.71,11.25 13.44,11.99 v1(22.76,11.99) 23.27,11.48 24.63,11.48 24.97,11.82 24.97,12.46 26.93,14.42 26.93,15.09 26.75,15.27 26.49,15.27 26.34,15.12 25.77,15.12 25.21,14.56 v1(25.21,14.53)
  Bottom Layer w0.254: 18.09,17.65 18.09,18.45 v1(18.01,18.53) ; C8.1 13.72,17.78 ; C8.1 C10.1 ; C8.1 C7.1 ; C10.1 13.84,17.02 ; C10.1 14.54,16.52 14.39,16.37 14.39,16.18 C5.1 14.3,15.35 C11.1 ; C27.1 21.21,15.37 ; C6.1 18.67,16.21 ; v1(18.01,20.13) 18.86,20.13 19.62,19.37 C28.1 C26.1 C25.1 C24.1 ; C38.1 23.27,17.4 v1(23.61,17.73) ; C7.1 13.84,18.54 ; C7.1 C9.1 13.84,19.18 ; C40.1 23.05,11.3 ; C34.1 23.54,22.63 23.62,22.55 23.62,23.5 ; C39.1 23.35,15.88 v1(23.61,16.13) ; C35.1 18.84,22.8 C31.1 16.88,22.8 v1(16.82,22.86)
  vias: v1(5.34,25.66) v1(5.34,20.58) v1(5.35,10.17) v1(5.34,5.34) v1(10.42,25.66) v1(10.42,20.58) v1(10.42,10.42) v1(10.42,5.34) v1(14.47,11.94) v1(15.5,25.66) v1(15.5,10.42) v1(15.5,5.34) v1(15.93,11.89) v1(16.41,19.33) v1(16.41,18.53) v1(16.41,17.73) v1(16.41,16.93) v1(18.59,11.87) v1(20.58,25.66) v1(25.66,25.66) v1(25.66,10.42) v1(35.82,25.66) v1(35.82,5.34) v1(40.9,25.66) v1(40.9,20.58) v1(40.9,15.5) v1(40.9,10.42) v1(40.9,5.34)
CAM_CLK: length 14.5
  Inner2 w0.254: v1(26.01,14.53) 26.01,14.52 25.79,14.3 25.79,14.29 25.45,13.95 25.44,13.95 24.07,12.57 12.76,12.57 v1(12.45,12.26)
MIPI1N: length 18.9
  Top Layer w0.254: v1(37.34,17.12) 36.93,17.12 36.79,17.26 FPC1.15
  Inner3 w0.232: v1(26.01,16.93) 26.12,16.93 27.31,15.75 27.91,15.75 arc(28.18,15.86) 28.29,16.13 28.29,16.85 arc(28.67,17.23) 29.05,16.85 29.05,16.13 arc(29.43,15.75) 29.81,16.13 29.81,16.85 arc(30.19,17.23) 30.58,16.85 30.58,16.13 arc(30.69,15.86) 30.96,15.75 32,15.75 33.93,17.68 36.53,17.68 37.08,17.12 v1(37.34,17.12)
MIPI1P: length 18.9
  Top Layer w0.254: FPC1.16 36.79,17.76 36.94,17.91 v1(37.34,17.91)
  Inner3 w0.232: v1(37.34,17.91) 37.54,17.71 37.58,17.71 37.92,17.36 37.92,16.88 37.42,16.38 37.08,16.38 36.19,17.27 34.17,17.27 32.21,15.31 25.83,15.31 25.59,15.55 24.97,15.55 24.62,15.89 24.62,16.38 25.18,16.93 v1(25.21,16.93)
MIPI2N: length 19
  Top Layer w0.254: 34.67,20.19 v1(34.67,20.18) 34.69,20.19 35.93,20.19 FPC1.21
  Inner3 w0.231: v1(26.01,18.53) 26.02,18.53 27.38,19.9 27.77,19.9 arc(28.04,19.79) 28.15,19.52 28.15,18.58 arc(28.53,18.2) 28.91,18.58 28.91,19.52 arc(29.29,19.9) 29.67,19.52 29.67,18.58 arc(30.05,18.2) 30.43,18.58 30.43,19.52 arc(30.81,19.9) 31.19,19.52 31.19,18.58 arc(31.58,18.2) 31.96,18.58 31.96,19.52 arc(32.07,19.79) 32.34,19.9 34.4,19.9 v1(34.67,20.18)
MIPI2P: length 18.9
  Top Layer w0.254: v1(34.13,20.77) 34.37,20.77 34.39,20.76 FPC1.22
  Inner3 w0.231: v1(34.13,20.77) 33.7,20.34 32.54,20.34 arc(32.28,20.45) 32.16,20.72 32.16,20.76 arc(31.78,21.14) 31.4,20.76 31.4,20.72 arc(31.02,20.34) 30.64,20.72 30.64,21.08 arc(30.26,21.46) 29.88,21.08 29.88,20.72 arc(29.5,20.34) 29.12,20.72 29.12,21.08 arc(28.73,21.46) 28.35,21.08 28.35,20.72 arc(27.97,20.34) 27.59,20.72 27.59,21.08 arc(27.21,21.46) 26.83,21.08 26.83,20.72 arc(26.72,20.45) 26.45,20.34 25.81,20.34 25.38,19.91 24.97,19.91 24.64,19.57 24.64,19.1 25.2,18.53 v1(25.21,18.53)
MIPI3N: length 18.9
  Top Layer w0.254: FPC1.12 35.12,15.76 34.98,15.62 v1(34.42,15.62)
  Bottom Layer w0.45: v1(26.01,16.13) 26.13,16.25 26.29,16.25 26.69,16.65 26.69,20.21 27.74,21.26 28.7,21.26 29.52,20.44 arc(29.62,20.21) 29.52,19.97 arc(29.42,19.74) 29.52,19.5 29.59,19.43 arc(29.82,19.34) 30.06,19.43 arc(30.29,19.53) 30.53,19.43 30.6,19.37 arc(30.7,19.13) 30.6,18.9 arc(30.5,18.66) 30.6,18.42 30.67,18.36 arc(30.9,18.26) 31.14,18.36 arc(31.37,18.45) 31.61,18.36 31.68,18.29 arc(31.77,18.05) 31.68,17.82 arc(31.58,17.58) 31.68,17.35 31.74,17.28 arc(31.98,17.18) 32.21,17.28 arc(32.45,17.38) 32.68,17.28 34.34,15.62 v1(34.42,15.62)
MIPI3P: length 18.9
  Top Layer w0.254: FPC1.13 35.2,16.26 35.08,16.38 v1(34.54,16.38)
  Bottom Layer w0.45: v1(25.21,16.13) 25.09,16.25 24.93,16.25 24.53,16.65 24.53,20.08 26.38,21.94 28.99,21.94 v1(34.54,16.38)
MIPI4N: length 18.9
  Top Layer w0.254: v1(34.85,21.67) 35.03,21.67 35.12,21.76 FPC1.24
  Inner2 w0.231: v1(26.01,19.33) 26.01,19.87 25.82,20.05 25.82,20.54 27.15,21.86 27.53,21.86 arc(27.8,21.75) 27.91,21.48 27.91,20.72 arc(28.29,20.34) 28.67,20.72 28.67,21.48 arc(29.05,21.86) 29.43,21.48 29.43,20.72 arc(29.81,20.34) 30.19,20.72 30.19,21.48 arc(30.57,21.86) 30.96,21.48 30.96,20.89 arc(31.34,20.51) 31.72,20.89 31.72,21.48 arc(31.83,21.75) 32.1,21.86 33.74,21.86 33.93,21.67 v1(34.85,21.67)
MIPI4P: length 18.9
  Top Layer w0.254: FPC1.25 35.19,22.26 35.02,22.43 v1(34.79,22.43)
  Inner2 w0.231: v1(25.21,19.33) 25.21,19.87 25.39,20.05 25.39,20.72 26.97,22.29 27.5,22.29 arc(27.77,22.4) 27.88,22.67 27.88,23.24 arc(28.26,23.62) 28.64,23.24 28.64,22.67 arc(29.02,22.29) 29.4,22.67 29.4,23.24 arc(29.78,23.62) 30.16,23.24 30.16,22.67 arc(30.54,22.29) 30.93,22.67 30.93,23.24 arc(31.31,23.62) 31.69,23.24 31.69,22.67 arc(31.8,22.4) 32.07,22.29 33.69,22.29 33.83,22.43 v1(34.79,22.43)
MIPI_CLK_N: length 18.9
  Top Layer w0.254: v1(33.53,18.44) 34.09,18.44 34.41,18.76 FPC1.18
  Inner2 w0.231: v1(26.01,17.73) 26.03,17.73 26.88,16.89 27.48,16.89 arc(27.75,17) 27.87,17.27 27.87,18.77 arc(28.25,19.16) 28.63,18.77 28.63,17.27 arc(29.01,16.89) 29.39,17.27 29.39,18.77 arc(29.77,19.16) 30.15,18.77 30.15,17.27 arc(30.26,17) 30.53,16.89 31.82,16.89 33.37,18.44 v1(33.53,18.44)
MIPI_CLK_P: length 18.9
  Top Layer w0.254: v1(33.53,19.3) 35.96,19.3 FPC1.19
  Inner2 w0.231: v1(33.53,19.3) 33.53,19.27 34.11,18.68 34.11,18.2 33.56,17.65 33.15,17.65 31.94,16.43 30.91,16.43 arc(30.65,16.32) 30.53,16.05 30.53,15.98 arc(30.15,15.6) 29.77,15.98 29.77,16.05 arc(29.39,16.43) 29.01,16.05 29.01,15.88 arc(28.63,15.49) 28.25,15.88 28.25,16.05 arc(28.14,16.32) 27.87,16.43 27.13,16.43 26.25,15.55 24.97,15.55 24.62,15.89 24.62,17.18 25.18,17.73 v1(25.21,17.73)
PWRON: length 11.2
  Top Layer w0.254: U6.2 31.04,5.01 31.88,5.84 31.88,9.02 33.12,10.26 FPC1.1
SCK: length 26.4
  Top Layer w0.254: v1(37.97,12.32) 37.91,12.26 FPC1.5
  Inner3 w0.254: v1(37.97,12.32) 37.35,12.32 35.53,10.5 34.01,10.5 33.77,10.26 33.29,10.26 33.05,10.5 26.78,10.5 20.41,16.87 v1(20.41,20.13)
SDI: length 20.2
  Top Layer w0.254: v1(33.27,12.04) 33.68,12.04 33.96,11.76 FPC1.4
  Inner3 w0.254: v1(21.21,20.13) 21.21,16.77 25.93,12.04 v1(33.27,12.04)
XCLR: length 34.5
  Top Layer w0.254: FPC1.2 33.61,10.76 v1(33.53,10.84)
  Inner2 w0.254: v1(33.53,10.84) 36.07,13.38 36.07,18.8 37.08,19.81 37.08,23.11 35.05,25.15 26.03,25.15 22.86,21.97 22.86,20.19 v1(22.81,20.13)
$1N3514: length 0.8
  Bottom Layer w0.254: C5.2 15.57,16.09 v1(15.61,16.13)
$1N3616: length 0.8
  Bottom Layer w0.254: C6.2 16.48,16.21 v1(16.41,16.13)
$1N4894: length 3.7
  Top Layer w0.254: 19.05,6.8 18.71,7.15 v1(18.71,7.31) ; 19.05,6.8 U4.B2 ; 19.05,6.8 19.42,7.17 v1(19.42,7.3) ; v1(18.03,9.27) 18.5,9.27 L1.1 18.61,8.36 v1(18.03,8.36)
$1N5592: length 1.2
  Top Layer w0.254: C23.2 17.21,20.94 U1.C11
$1N6784: length 1.6
  Top Layer w0.254: R1.2 19.61,22.44 U1.F11
$1N6846: length 2.5
  Inner2 w0.254: v1(22.22,22.57) 22.01,22.36 v1(22.01,20.13)
$1N8560: length 2.1
  Top Layer w0.254: U6.5 23.41,6.31 22.99,6.73 C42.1

## Copper pours and planes (outline as drawn; the poured copper is in the pictures)
1.2V on Top Layer: 19.33,6.47 20.31,6.47 20.83,6.98 20.81,7 20.81,7.39 20.58,7.62 19.81,7.62 19.81,11.77 22.23,11.77 22.23,5.14 19.33,5.14
1.2V on Inner4: 24.97,20.93 24.13,20.93 24.13,10.03 22.61,10.03 22.61,5.21 20.19,5.21 20.19,10.03 17.15,10.03 17.15,23.37 24.13,23.37 24.13,23.24 24.97,23.24
2.9V on Inner4: 8,20.96 16.89,20.96 16.89,13.08 8,13.08
+5V on Inner4: 3.43,25.78 42.16,25.78 42.16,3.18 3.43,3.18
GND on Top Layer: -0.13,30.35 42.16,30.35 42.16,0.25 -0.13,0.25
GND on Bottom Layer: 0,30.23 42.16,30.23 42.16,0.13 0,0.13
GND on Inner1: 0.26,29.97 41.78,29.97 41.78,0.26 0.26,0.26
$1N4894 on Inner4: 17.53,9.78 17.54,9.76 18.5,9.76 19.81,9.76 19.81,6.47 18.69,6.47 17.53,7.64

## Text on the board
Bottom Silkscreen Layer: Suggest Using M12 lenses | LENSES MUST BE ALIGNED WITH OPTICAL CENTER
Top Silkscreen Layer: CAUTION: CMOS Exposed | 1cm Reference | Optical Center / Reference | Connection cable must maintain / 100ohm differential impendence
